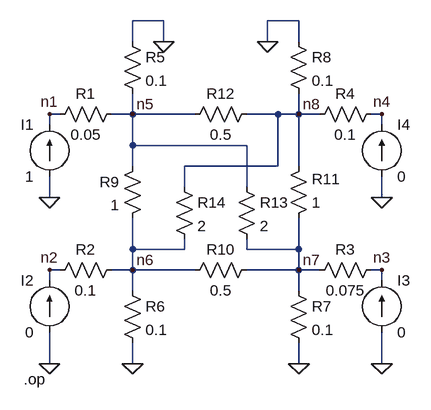
[diagram p0: schematic model.asc]
model.asc, the LTspice schematic file:
Version 4
SHEET 1 880 680
WIRE 272 -80 224 -80
WIRE 480 -80 432 -80
WIRE 224 -48 224 -80
WIRE 272 -48 272 -80
WIRE 432 -48 432 -80
WIRE 480 -48 480 -80
WIRE 112 64 96 64
WIRE 224 64 224 32
WIRE 224 64 192 64
WIRE 320 64 224 64
WIRE 448 64 400 64
WIRE 480 64 480 32
WIRE 480 64 448 64
WIRE 512 64 480 64
WIRE 608 64 592 64
WIRE 96 80 96 64
WIRE 608 80 608 64
WIRE 224 112 224 64
WIRE 400 112 224 112
WIRE 224 144 224 112
WIRE 448 144 448 64
WIRE 448 144 304 144
WIRE 480 144 480 64
WIRE 304 176 304 144
WIRE 400 176 400 112
WIRE 96 192 96 160
WIRE 608 192 608 160
WIRE 224 272 224 224
WIRE 304 272 304 256
WIRE 304 272 224 272
WIRE 400 272 400 256
WIRE 480 272 480 224
WIRE 480 272 400 272
WIRE 112 304 96 304
WIRE 224 304 224 272
WIRE 224 304 192 304
WIRE 320 304 224 304
WIRE 480 304 480 272
WIRE 480 304 400 304
WIRE 512 304 480 304
WIRE 608 304 592 304
WIRE 96 320 96 304
WIRE 608 320 608 304
WIRE 224 336 224 304
WIRE 480 336 480 304
WIRE 96 448 96 400
WIRE 224 448 224 416
WIRE 480 448 480 416
WIRE 608 448 608 400
FLAG 224 448 0
FLAG 480 448 0
FLAG 432 -48 0
FLAG 272 -48 0
FLAG 608 192 0
FLAG 608 448 0
FLAG 96 448 0
FLAG 96 192 0
FLAG 96 64 n1
FLAG 96 304 n2
FLAG 608 304 n3
FLAG 608 64 n4
FLAG 224 64 n5
FLAG 224 304 n6
FLAG 480 304 n7
FLAG 480 64 n8
SYMBOL res 208 48 R90
WINDOW 0 0 56 VBottom 2
WINDOW 3 32 56 VTop 2
SYMATTR InstName R1
SYMATTR Value 0.05
SYMBOL res 96 320 R270
WINDOW 0 32 56 VTop 2
WINDOW 3 0 56 VBottom 2
SYMATTR InstName R2
SYMATTR Value 0.1
SYMBOL res 496 320 R270
WINDOW 0 32 56 VTop 2
WINDOW 3 0 56 VBottom 2
SYMATTR InstName R3
SYMATTR Value 0.075
SYMBOL res 496 80 R270
WINDOW 0 32 56 VTop 2
WINDOW 3 0 56 VBottom 2
SYMATTR InstName R4
SYMATTR Value 0.1
SYMBOL res 208 -64 R0
SYMATTR InstName R5
SYMATTR Value 0.1
SYMBOL res 208 320 R0
SYMATTR InstName R6
SYMATTR Value 0.1
SYMBOL res 464 320 R0
SYMATTR InstName R7
SYMATTR Value 0.1
SYMBOL res 464 -64 R0
SYMATTR InstName R8
SYMATTR Value 0.1
SYMBOL res 240 128 M0
SYMATTR InstName R9
SYMATTR Value 1
SYMBOL res 416 288 R90
WINDOW 0 0 56 VBottom 2
WINDOW 3 32 56 VTop 2
SYMATTR InstName R10
SYMATTR Value 0.5
SYMBOL res 464 240 M180
WINDOW 0 36 76 Left 2
WINDOW 3 36 40 Left 2
SYMATTR InstName R11
SYMATTR Value 1
SYMBOL res 416 48 R90
WINDOW 0 0 56 VBottom 2
WINDOW 3 32 56 VTop 2
SYMATTR InstName R12
SYMATTR Value 0.5
SYMBOL res 384 160 R0
SYMATTR InstName R13
SYMATTR Value 2
SYMBOL res 288 160 R0
SYMATTR InstName R14
SYMATTR Value 2
SYMBOL current 96 160 R180
WINDOW 0 24 80 Left 2
WINDOW 3 24 0 Left 2
WINDOW 123 0 0 Left 2
WINDOW 39 0 0 Left 2
SYMATTR InstName I1
SYMATTR Value 1
SYMBOL current 96 400 R180
WINDOW 0 24 80 Left 2
WINDOW 3 24 0 Left 2
WINDOW 123 0 0 Left 2
WINDOW 39 0 0 Left 2
SYMATTR InstName I2
SYMATTR Value 0
SYMBOL current 608 400 M180
WINDOW 0 24 80 Left 2
WINDOW 3 24 0 Left 2
WINDOW 123 0 0 Left 2
WINDOW 39 0 0 Left 2
SYMATTR InstName I3
SYMATTR Value 0
SYMBOL current 608 160 M180
WINDOW 0 24 80 Left 2
WINDOW 3 24 0 Left 2
WINDOW 123 0 0 Left 2
WINDOW 39 0 0 Left 2
SYMATTR InstName I4
SYMATTR Value 0
TEXT 56 472 Left 2 !.op

The netlist it stands for:
* model.asc
R1 n5 n1 0.05
R2 n2 n6 0.1
R3 n7 n3 0.075
R4 n8 n4 0.1
R5 0 n5 0.1
R6 n6 0 0.1
R7 n7 0 0.1
R8 0 n8 0.1
R9 n5 n6 1
R10 n7 n6 0.5
R11 n7 n8 1
R12 n8 n5 0.5
R13 n5 n7 2
R14 n8 n6 2
I1 0 n1 1
I2 0 n2 0
I3 0 n3 0
I4 0 n4 0
.op
.backanno
.end